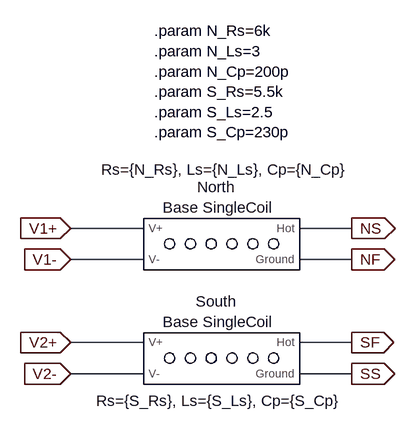
[diagram p0: schematic Base_Humbucker.asc]
Base_Humbucker.asc, the LTspice schematic file:
Version 4
SHEET 1 880 680
WIRE 96 112 -16 112
WIRE 416 112 336 112
WIRE 96 160 -16 160
WIRE 416 160 336 160
WIRE 96 288 -16 288
WIRE 416 288 336 288
WIRE 96 336 -16 336
WIRE 416 336 336 336
FLAG -16 112 V1+
IOPIN -16 112 In
FLAG -16 160 V1-
IOPIN -16 160 In
FLAG -16 288 V2+
IOPIN -16 288 In
FLAG -16 336 V2-
IOPIN -16 336 In
FLAG 416 112 NS
IOPIN 416 112 Out
FLAG 416 160 NF
IOPIN 416 160 Out
FLAG 416 288 SF
IOPIN 416 288 Out
FLAG 416 336 SS
IOPIN 416 336 Out
SYMBOL Base_SingleCoil 208 128 R0
WINDOW 39 14 -91 Bottom 2
SYMATTR SpiceLine Rs={N_Rs}, Ls={N_Ls}, Cp={N_Cp}
SYMATTR InstName North
SYMBOL Base_SingleCoil 208 304 R0
WINDOW 39 4 89 Bottom 2
SYMATTR SpiceLine Rs={S_Rs}, Ls={S_Ls}, Cp={S_Cp}
SYMATTR InstName South
TEXT 112 -192 Left 2 !.param N_Rs=6k\n.param N_Ls=3\n.param N_Cp=200p\n.param S_Rs=5.5k\n.param S_Ls=2.5\n.param S_Cp=230p

The netlist it stands for:
* Base_Humbucker.asc
XNorth V1+ V1- NS NF Base SingleCoil Rs={N_Rs}, Ls={N_Ls}, Cp={N_Cp}  ; pins V+ V- Hot Ground
XSouth V2+ V2- SF SS Base SingleCoil Rs={S_Rs}, Ls={S_Ls}, Cp={S_Cp}  ; pins V+ V- Hot Ground
.param N_Rs=6k
.param N_Ls=3
.param N_Cp=200p
.param S_Rs=5.5k
.param S_Ls=2.5
.param S_Cp=230p
.backanno
.end